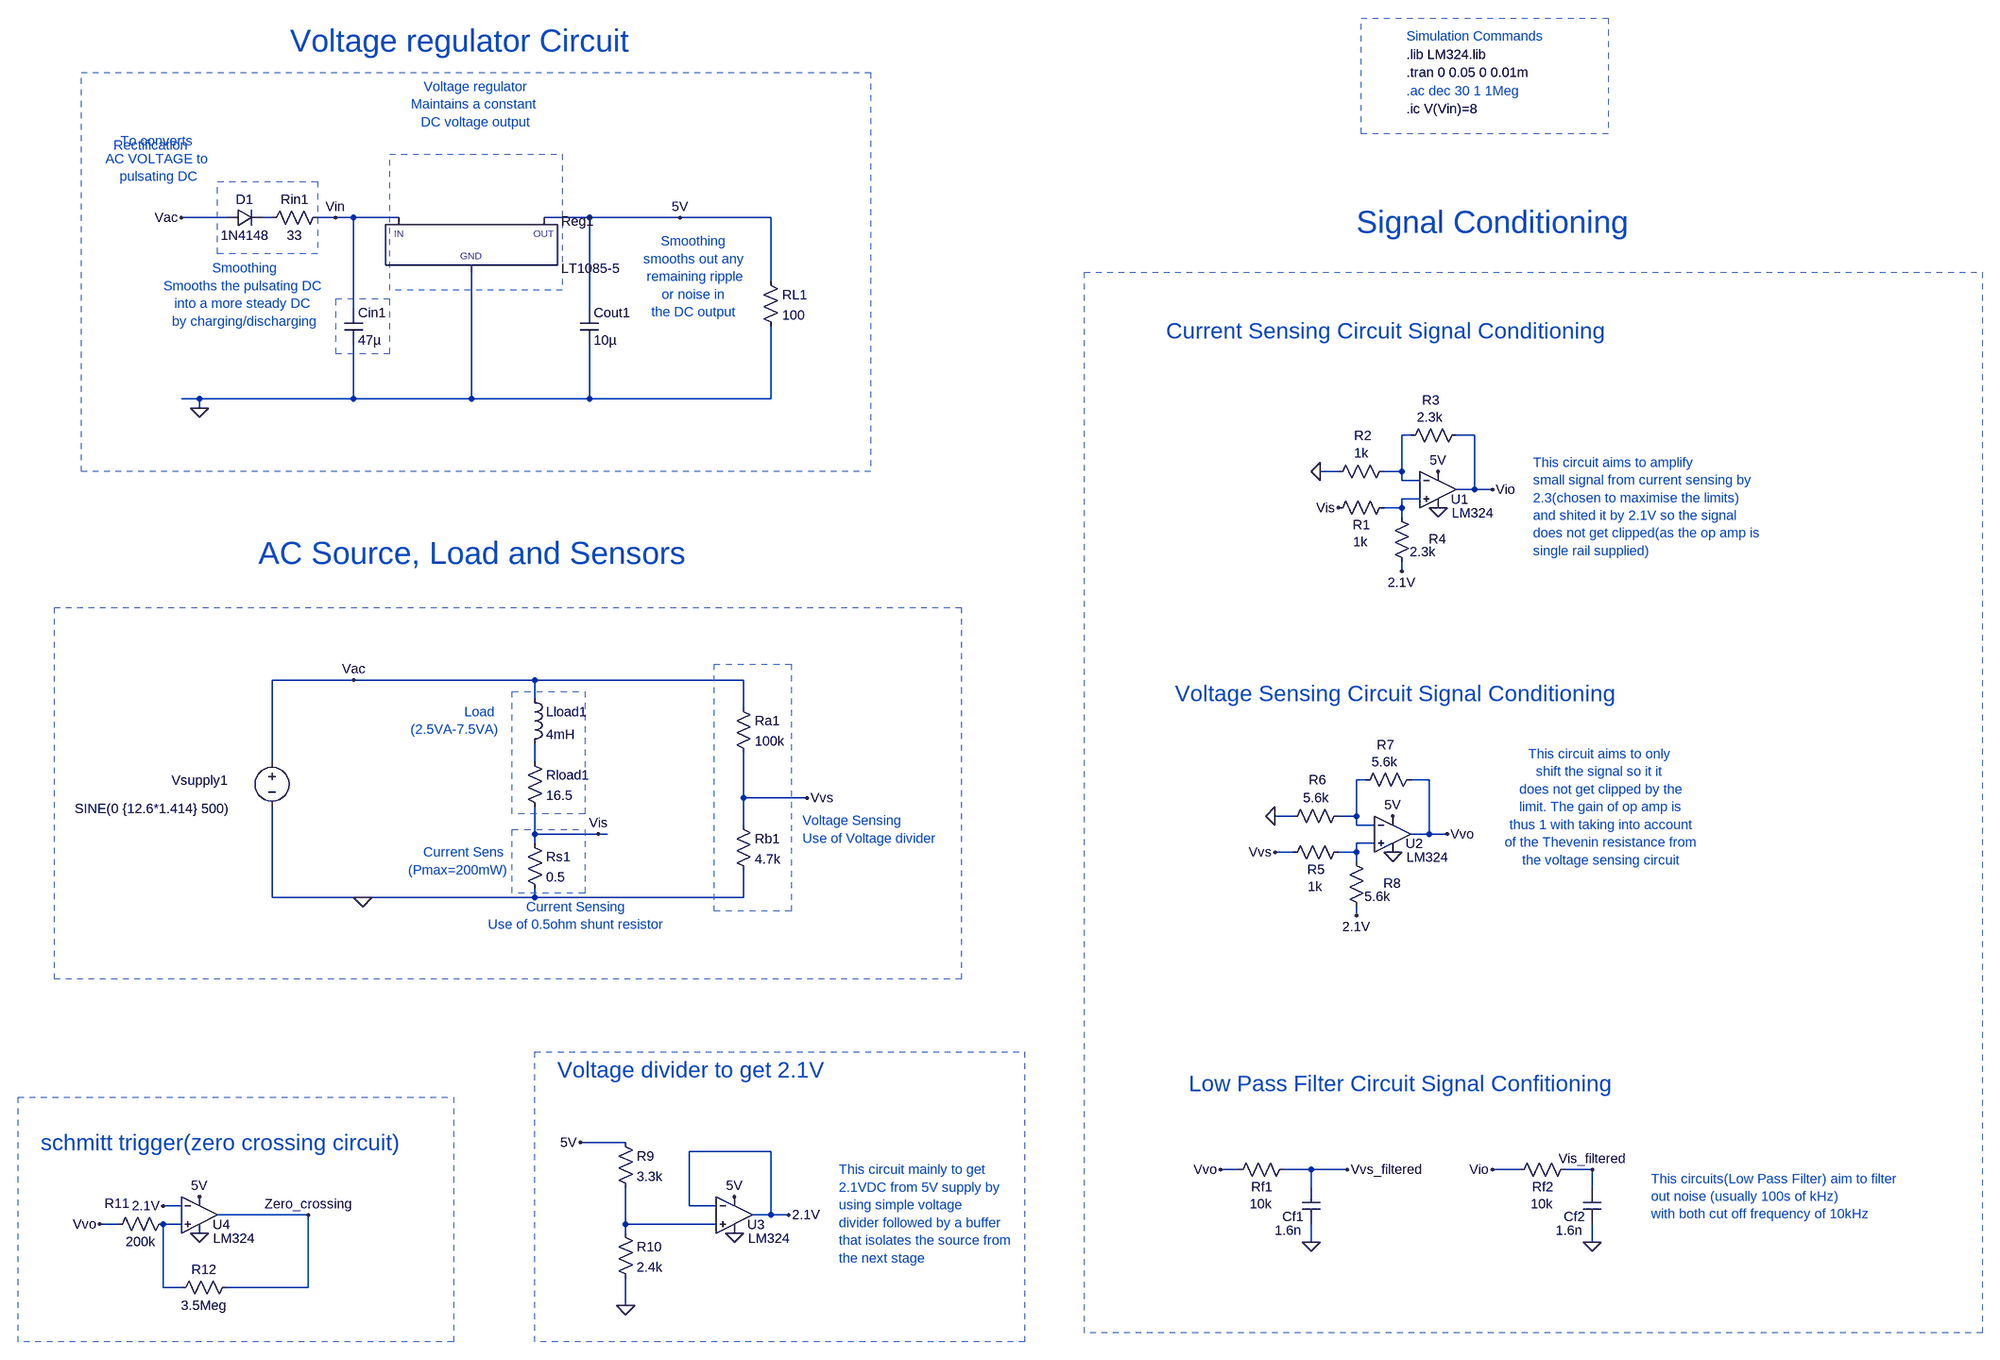
[diagram p0: schematic copy.asc]
copy.asc, the LTspice schematic file:
Version 4.1
SHEET 1 2836 1620
WIRE -448 -976 -528 -976
WIRE -368 -976 -384 -976
WIRE -256 -976 -288 -976
WIRE -224 -976 -256 -976
WIRE -144 -976 -224 -976
WIRE 192 -976 112 -976
WIRE 352 -976 192 -976
WIRE 512 -976 352 -976
WIRE 512 -864 512 -976
WIRE -224 -816 -224 -976
WIRE 192 -816 192 -976
WIRE -496 -656 -528 -656
WIRE -224 -656 -224 -752
WIRE -224 -656 -496 -656
WIRE -16 -656 -16 -880
WIRE -16 -656 -224 -656
WIRE 192 -656 192 -752
WIRE 192 -656 -16 -656
WIRE 512 -656 512 -784
WIRE 512 -656 192 -656
WIRE -496 -640 -496 -656
WIRE 1680 -592 1664 -592
WIRE 1792 -592 1760 -592
WIRE 1552 -528 1520 -528
WIRE 1664 -528 1664 -592
WIRE 1664 -528 1632 -528
WIRE 1664 -512 1664 -528
WIRE 1696 -512 1664 -512
WIRE 1792 -496 1792 -592
WIRE 1792 -496 1760 -496
WIRE 1824 -496 1792 -496
WIRE 1696 -480 1664 -480
WIRE 1664 -464 1664 -480
WIRE 1664 -464 1632 -464
WIRE 1664 -448 1664 -464
WIRE 1664 -352 1664 -368
WIRE -224 -160 -368 -160
WIRE 96 -160 -224 -160
WIRE 464 -160 96 -160
WIRE 96 -128 96 -160
WIRE 464 -112 464 -160
WIRE -368 -16 -368 -160
WIRE 96 -16 96 -48
WIRE 1600 16 1584 16
WIRE 1712 16 1680 16
WIRE 464 48 464 -32
WIRE 576 48 464 48
WIRE 1472 80 1440 80
WIRE 1584 80 1584 16
WIRE 1584 80 1552 80
WIRE 464 96 464 48
WIRE 1584 96 1584 80
WIRE 1616 96 1584 96
WIRE 96 112 96 64
WIRE 208 112 96 112
WIRE 224 112 208 112
WIRE 1712 112 1712 16
WIRE 1712 112 1680 112
WIRE 1744 112 1712 112
WIRE 96 128 96 112
WIRE 1616 128 1584 128
WIRE 1472 144 1440 144
WIRE 1584 144 1584 128
WIRE 1584 144 1552 144
WIRE 1584 160 1584 144
WIRE -368 224 -368 64
WIRE -208 224 -368 224
WIRE 96 224 96 208
WIRE 96 224 -208 224
WIRE 464 224 464 176
WIRE 464 224 96 224
WIRE 1584 256 1584 240
WIRE 256 656 176 656
WIRE 512 672 368 672
WIRE 1376 704 1344 704
WIRE 1504 704 1456 704
WIRE 1568 704 1504 704
WIRE 1872 704 1824 704
WIRE 2000 704 1952 704
WIRE 1504 736 1504 704
WIRE 2000 736 2000 704
WIRE -528 768 -560 768
WIRE 368 768 368 672
WIRE 416 768 368 768
WIRE -304 784 -464 784
WIRE 512 784 512 672
WIRE 512 784 480 784
WIRE 544 784 512 784
WIRE -640 800 -672 800
WIRE -528 800 -560 800
WIRE 256 800 256 736
WIRE 416 800 256 800
WIRE 256 816 256 800
WIRE 1504 832 1504 800
WIRE 2000 832 2000 800
WIRE -560 912 -560 800
WIRE -528 912 -560 912
WIRE -304 912 -304 784
WIRE -304 912 -448 912
WIRE 256 944 256 896
FLAG -208 224 0
FLAG -224 -160 Vac
FLAG 208 112 Vis
FLAG 576 48 Vvs
FLAG 1728 -464 0
FLAG 1728 -528 5V
FLAG 1520 -528 0
FLAG 1824 -496 Vio
FLAG 1664 -352 2.1V
FLAG 1648 144 0
FLAG 1648 80 5V
FLAG 1440 144 Vvs
FLAG 1440 80 0
FLAG 1744 112 Vvo
FLAG 1584 256 2.1V
FLAG -496 -640 0
FLAG -528 -976 Vac
FLAG 352 -976 5V
FLAG -256 -976 Vin
FLAG 256 944 0
FLAG 176 656 5V
FLAG 448 752 5V
FLAG 448 816 0
FLAG 544 784 2.1V
FLAG 1504 832 0
FLAG 1344 704 Vvo
FLAG 1568 704 Vvs_filtered
FLAG -560 768 2.1V
FLAG -672 800 Vvo
FLAG -496 816 0
FLAG -496 752 5V
FLAG 2000 832 0
FLAG 1824 704 Vio
FLAG 2000 704 Vis_filtered
FLAG 1552 -464 Vis
FLAG -304 784 Zero_crossing
SYMBOL voltage -368 -32 R0
WINDOW 0 -177 49 Left 2
WINDOW 3 -348 99 Left 2
WINDOW 123 0 0 Left 0
WINDOW 39 0 0 Left 0
SYMATTR InstName Vsupply1
SYMATTR Value SINE(0 {12.6*1.414} 500)
SYMBOL res 80 -32 R0
SYMATTR InstName Rload1
SYMATTR Value 16.5
SYMBOL ind 80 -144 R0
SYMATTR InstName Lload1
SYMATTR Value 4mH
SYMBOL res 80 112 R0
SYMATTR InstName Rs1
SYMATTR Value 0.5
SYMBOL res 448 -128 R0
SYMATTR InstName Ra1
SYMATTR Value 100k
SYMBOL res 448 80 R0
SYMATTR InstName Rb1
SYMATTR Value 4.7k
SYMBOL Opamps/opamp2 1728 -560 R0
WINDOW 0 23 81 Left 2
WINDOW 3 24 105 Left 2
SYMATTR InstName U1
SYMATTR Value LM324
SYMBOL res 1648 -480 R90
WINDOW 0 62 55 VBottom 2
WINDOW 3 61 57 VTop 2
SYMATTR InstName R1
SYMATTR Value 1k
SYMBOL res 1648 -544 R90
WINDOW 0 -32 53 VBottom 2
WINDOW 3 -32 55 VTop 2
SYMATTR InstName R2
SYMATTR Value 1k
SYMBOL res 1776 -608 R90
WINDOW 0 -30 61 VBottom 2
WINDOW 3 -31 62 VTop 2
SYMATTR InstName R3
SYMATTR Value 2.3k
SYMBOL res 1680 -352 R180
WINDOW 0 -62 57 Left 2
WINDOW 3 -44 34 Left 2
SYMATTR InstName R4
SYMATTR Value 2.3k
SYMBOL Opamps/opamp2 1648 48 R0
WINDOW 0 23 81 Left 2
WINDOW 3 24 105 Left 2
SYMATTR InstName U2
SYMATTR Value LM324
SYMBOL res 1568 128 R90
WINDOW 0 62 55 VBottom 2
WINDOW 3 61 57 VTop 2
SYMATTR InstName R5
SYMATTR Value 1k
SYMBOL res 1568 64 R90
WINDOW 0 -32 53 VBottom 2
WINDOW 3 -32 55 VTop 2
SYMATTR InstName R6
SYMATTR Value 5.6k
SYMBOL res 1696 0 R90
WINDOW 0 -30 61 VBottom 2
WINDOW 3 -31 62 VTop 2
SYMATTR InstName R7
SYMATTR Value 5.6k
SYMBOL res 1600 256 R180
WINDOW 0 -62 57 Left 2
WINDOW 3 -44 34 Left 2
SYMATTR InstName R8
SYMATTR Value 5.6k
SYMBOL PowerProducts/LT1085-5 -16 -976 R0
SYMATTR InstName Reg1
SYMBOL res 496 -880 R0
SYMATTR InstName RL1
SYMATTR Value 100
SYMBOL res -272 -992 R90
WINDOW 0 0 56 VBottom 2
WINDOW 3 32 56 VTop 2
SYMATTR InstName Rin1
SYMATTR Value 33
SYMBOL diode -448 -960 R270
WINDOW 0 32 32 VTop 2
WINDOW 3 0 32 VBottom 2
SYMATTR InstName D1
SYMATTR Value 1N4148
SYMBOL cap -240 -816 R0
SYMATTR InstName Cin1
SYMATTR Value 47µ
SYMATTR SpiceLine Rser=0.001
SYMBOL cap 176 -816 R0
SYMATTR InstName Cout1
SYMATTR Value 10µ
SYMATTR SpiceLine Rser=0.001
SYMBOL res 240 640 R0
SYMATTR InstName R9
SYMATTR Value 3.3k
SYMBOL res 240 800 R0
SYMATTR InstName R10
SYMATTR Value 2.4k
SYMBOL Opamps/opamp2 448 720 R0
WINDOW 0 23 81 Left 2
WINDOW 3 24 105 Left 2
SYMATTR InstName U3
SYMATTR Value LM324
SYMBOL res 1472 688 R90
WINDOW 0 62 55 VBottom 2
WINDOW 3 61 57 VTop 2
SYMATTR InstName Rf1
SYMATTR Value 10k
SYMBOL cap 1520 800 R180
WINDOW 0 29 13 Left 2
WINDOW 3 33 -11 Left 2
SYMATTR InstName Cf1
SYMATTR Value 1.6n
SYMBOL Opamps/opamp2 -496 720 R0
WINDOW 0 23 81 Left 2
WINDOW 3 24 105 Left 2
SYMATTR InstName U4
SYMATTR Value LM324
SYMBOL res -544 784 R90
WINDOW 0 -5 97 VBottom 2
WINDOW 3 32 56 VTop 2
SYMATTR InstName R11
SYMATTR Value 200k
SYMBOL res -432 896 R90
WINDOW 0 0 56 VBottom 2
WINDOW 3 32 56 VTop 2
SYMATTR InstName R12
SYMATTR Value 3.5Meg
SYMBOL res 1968 688 R90
WINDOW 0 62 55 VBottom 2
WINDOW 3 61 57 VTop 2
SYMATTR InstName Rf2
SYMATTR Value 10k
SYMBOL cap 2016 800 R180
WINDOW 0 29 13 Left 2
WINDOW 3 33 -11 Left 2
SYMATTR InstName Cf2
SYMATTR Value 1.6n
TEXT 32 -104 Right 2 ;Load \n(2.5VA-7.5VA)
TEXT 48 144 Right 2 ;Current Sens \n(Pmax=200mW)
TEXT 1248 -776 Left 4 ;Current Sensing Circuit Signal Conditioning
TEXT 1264 -136 Left 4 ;Voltage Sensing Circuit Signal Conditioning
TEXT -392 -384 Left 5 ;AC Source, Load and Sensors
TEXT -336 -1288 Left 5 ;Voltage regulator Circuit
TEXT 1672 -1200 Left 2 ;.ac dec 30 1 1Meg
TEXT 1672 -1264 Left 2 !.lib LM324.lib
TEXT 1672 -1296 Left 2 ;Simulation Commands
TEXT 1672 -1232 Left 2 !.tran 0 0.05 0 0.01m
TEXT 1672 -1168 Left 2 !.ic V(Vin)=8
TEXT 136 528 Left 4 ;Voltage divider to get 2.1V
TEXT 1288 552 Left 4 ;Low Pass Filter Circuit Signal Confitioning
TEXT -776 656 Left 4 ;schmitt trigger(zero crossing circuit)
TEXT -648 -1104 Left 2 ;Rectification
TEXT -416 -840 Center 2 ;Smoothing\nSmooths the pulsating DC \ninto a more steady DC \nby charging/discharging
TEXT -8 -1176 Center 2 ;Voltage regulator\nMaintains a constant \nDC voltage output
TEXT -568 -1080 Center 2 ;To converts \nAC VOLTAGE to \npulsating DC
TEXT 376 -872 Center 2 ;Smoothing\nsmooths out any\n remaining ripple\n or noise in \nthe DC output
TEXT 168 256 Center 2 ;Current Sensing\nUse of 0.5ohm shunt resistor
TEXT 568 88 Left 2 ;Voltage Sensing\nUse of Voltage divider
TEXT 632 704 Left 2 ;This circuit mainly to get\n2.1VDC from 5V supply by \nusing simple voltage \ndivider followed by a buffer \nthat isolates the source from\nthe next stage
TEXT 1896 -544 Left 2 ;This circuit aims to amplify \nsmall signal from current sensing by \n2.3(chosen to maximise the limits)\nand shited it by 2.1V so the signal\ndoes not get clipped(as the op amp is \nsingle rail supplied)
TEXT 2016 64 Center 2 ;This circuit aims to only \nshift the signal so it it \ndoes not get clipped by the\nlimit. The gain of op amp is\nthus 1 with taking into account\nof the Thevenin resistance from\nthe voltage sensing circuit
TEXT 2104 720 Left 2 ;This circuits(Low Pass Filter) aim to filter \nout noise (usually 100s of kHz)\nwith both cut off frequency of 10kHz
TEXT 1584 -968 Left 5 ;Signal Conditioning
RECTANGLE Normal 56 -140 184 76 2
RECTANGLE Normal 56 104 184 216 2
RECTANGLE Normal 412 -188 548 248 2
RECTANGLE Normal 1592 -1328 2028 -1124 2
RECTANGLE Normal -288 -912 -464 -1040 2
RECTANGLE Normal -256 -736 -160 -832 2
RECTANGLE Normal 144 -848 -160 -1088 2
RECTANGLE Normal -48 1008 -816 576 2
RECTANGLE Normal 960 1008 96 496 2
RECTANGLE Normal 2688 992 1104 -880 2
RECTANGLE Normal 688 -528 -704 -1232 2
RECTANGLE Normal 848 368 -752 -288 2

The netlist it stands for:
* copy.asc
Vsupply1 Vac 0 SINE(0 {12.6*1.414} 500)
Rload1 N004 Vis 16.5
Lload1 Vac N004 4mH
Rs1 Vis 0 0.5
Ra1 Vac Vvs 100k
Rb1 Vvs 0 4.7k
X§U1 N003 N002 5V 0 Vio LM324  ; pins In+ In- V+ V- OUT
R1 N003 Vis 1k
R2 N002 0 1k
R3 Vio N002 2.3k
R4 2.1V N003 2.3k
X§U2 N006 N005 5V 0 Vvo LM324  ; pins In+ In- V+ V- OUT
R5 N006 Vvs 1k
R6 N005 0 5.6k
R7 Vvo N005 5.6k
R8 2.1V N006 5.6k
X§Reg1 0 5V Vin LT1085-5  ; pins GND OUT IN
RL1 5V 0 100
Rin1 Vin N001 33
D1 Vac N001 1N4148
Cin1 Vin 0 47µ Rser=0.001
Cout1 5V 0 10µ Rser=0.001
R9 5V N008 3.3k
R10 N008 0 2.4k
X§U3 N008 2.1V 5V 0 2.1V LM324  ; pins In+ In- V+ V- OUT
Rf1 Vvs_filtered Vvo 10k
Cf1 0 Vvs_filtered 1.6n
X§U4 N007 2.1V 5V 0 Zero_crossing LM324  ; pins In+ In- V+ V- OUT
R11 N007 Vvo 200k
R12 Zero_crossing N007 3.5Meg
Rf2 Vis_filtered Vio 10k
Cf2 0 Vis_filtered 1.6n
.model D D
.lib standard.dio
* Load
* (2.5VA-7.5VA)
* Current Sens
* (Pmax=200mW)
* Current Sensing Circuit Signal Conditioning
* Voltage Sensing Circuit Signal Conditioning
* AC Source, Load and Sensors
* Voltage regulator Circuit
* .ac dec 30 1 1Meg
.lib LM324.lib
* Simulation Commands
.tran 0 0.05 0 0.01m
.ic V(Vin)=8
* Voltage divider to get 2.1V
* Low Pass Filter Circuit Signal Confitioning
* schmitt trigger(zero crossing circuit)
* Rectification
* Smoothing
* Smooths the pulsating DC
* into a more steady DC
* by charging/discharging
* Voltage regulator
* Maintains a constant
* DC voltage output
* To converts
* AC VOLTAGE to
* pulsating DC
* Smoothing
* smooths out any
*  remaining ripple
*  or noise in
* the DC output
* Current Sensing
* Use of 0.5ohm shunt resistor
* Voltage Sensing
* Use of Voltage divider
* This circuit mainly to get
* 2.1VDC from 5V supply by
* using simple voltage
* divider followed by a buffer
* that isolates the source from
* the next stage
* This circuit aims to amplify
* small signal from current sensing by
* 2.3(chosen to maximise the limits)
* and shited it by 2.1V so the signal
* does not get clipped(as the op amp is
* single rail supplied)
* This circuit aims to only
* shift the signal so it it
* does not get clipped by the
* limit. The gain of op amp is
* thus 1 with taking into account
* of the Thevenin resistance from
* the voltage sensing circuit
* This circuits(Low Pass Filter) aim to filter
* out noise (usually 100s of kHz)
* with both cut off frequency of 10kHz
* Signal Conditioning
.backanno
.end